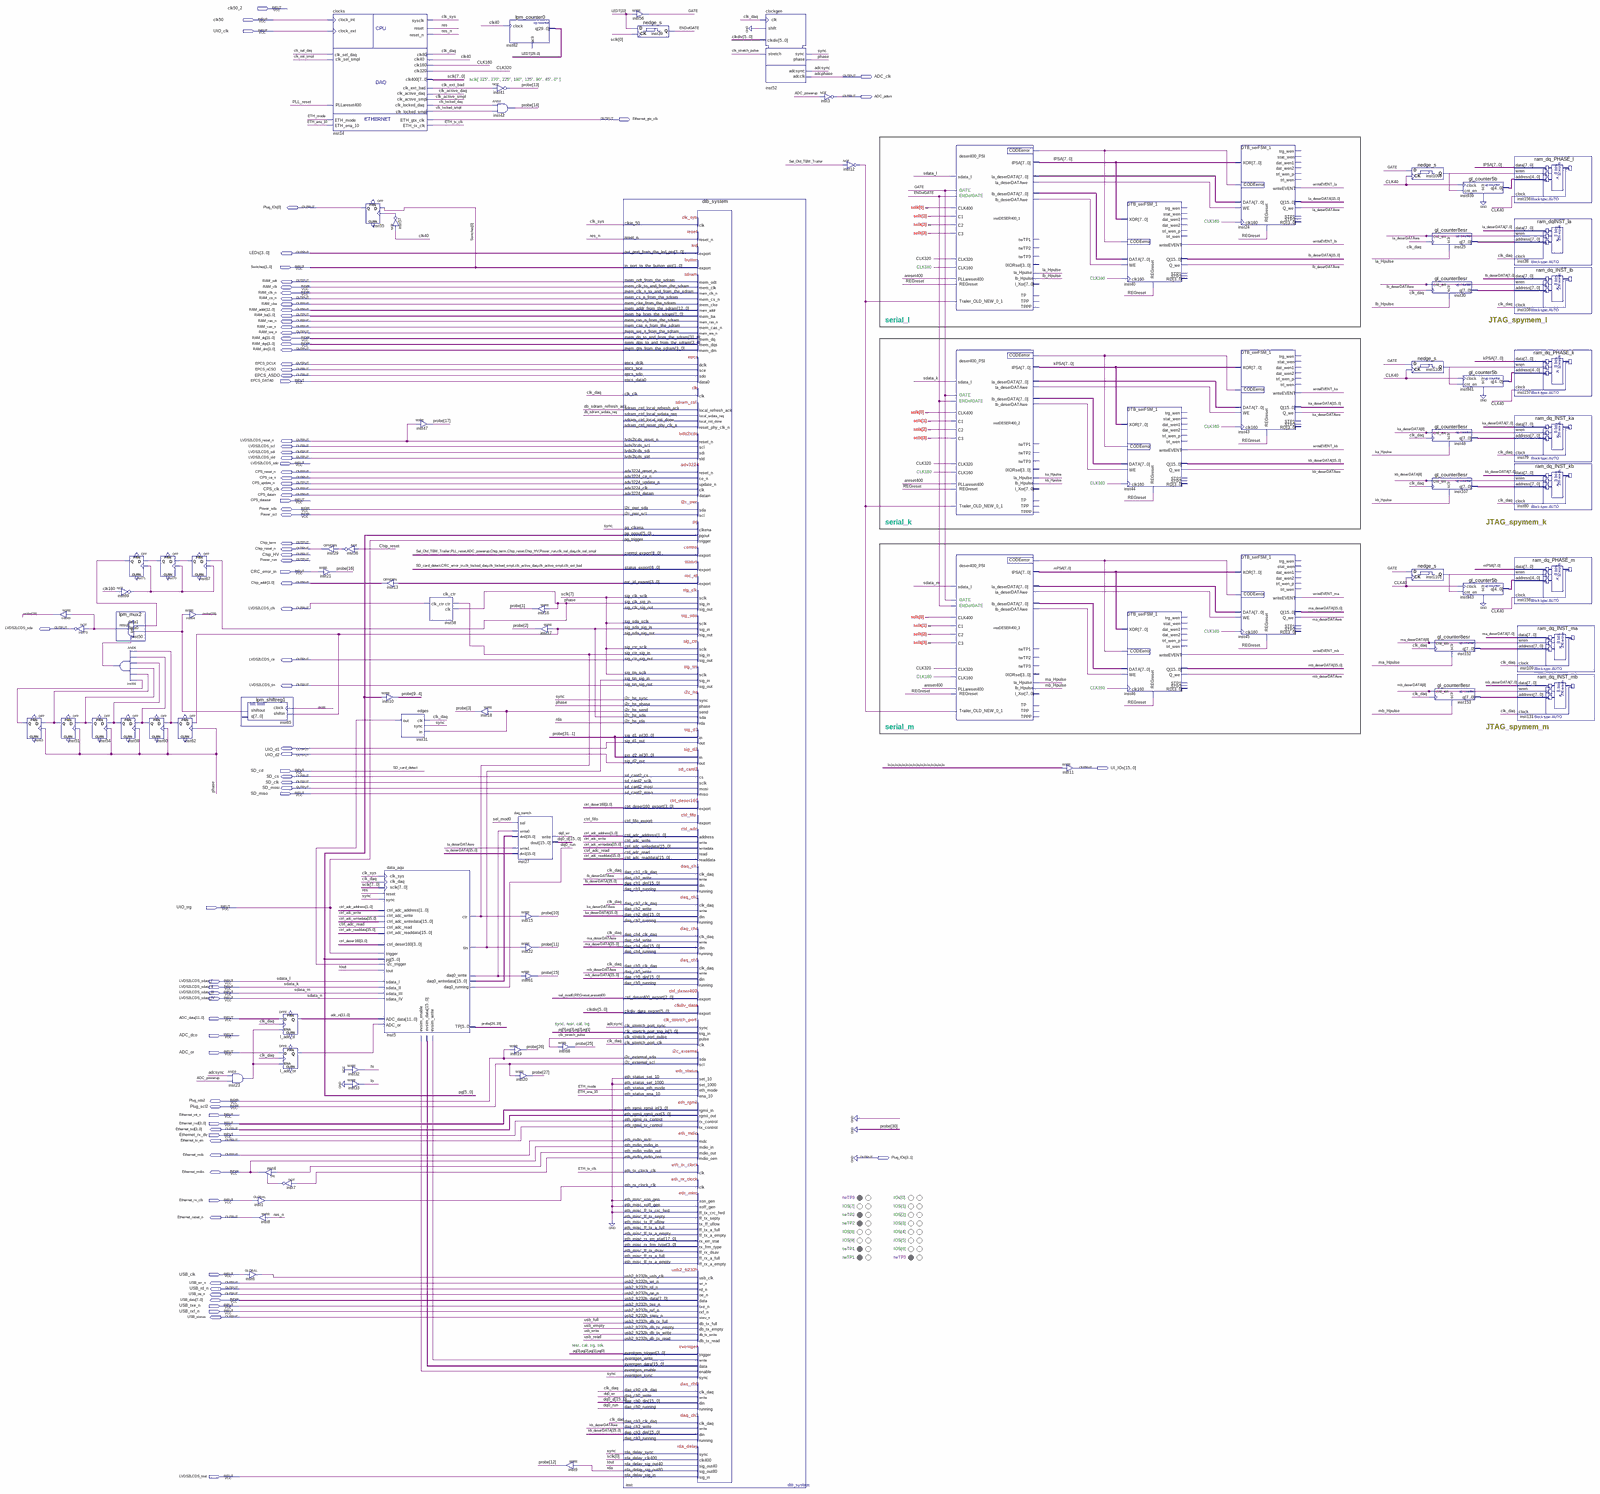
[diagram p0: schematic sheet, whole]
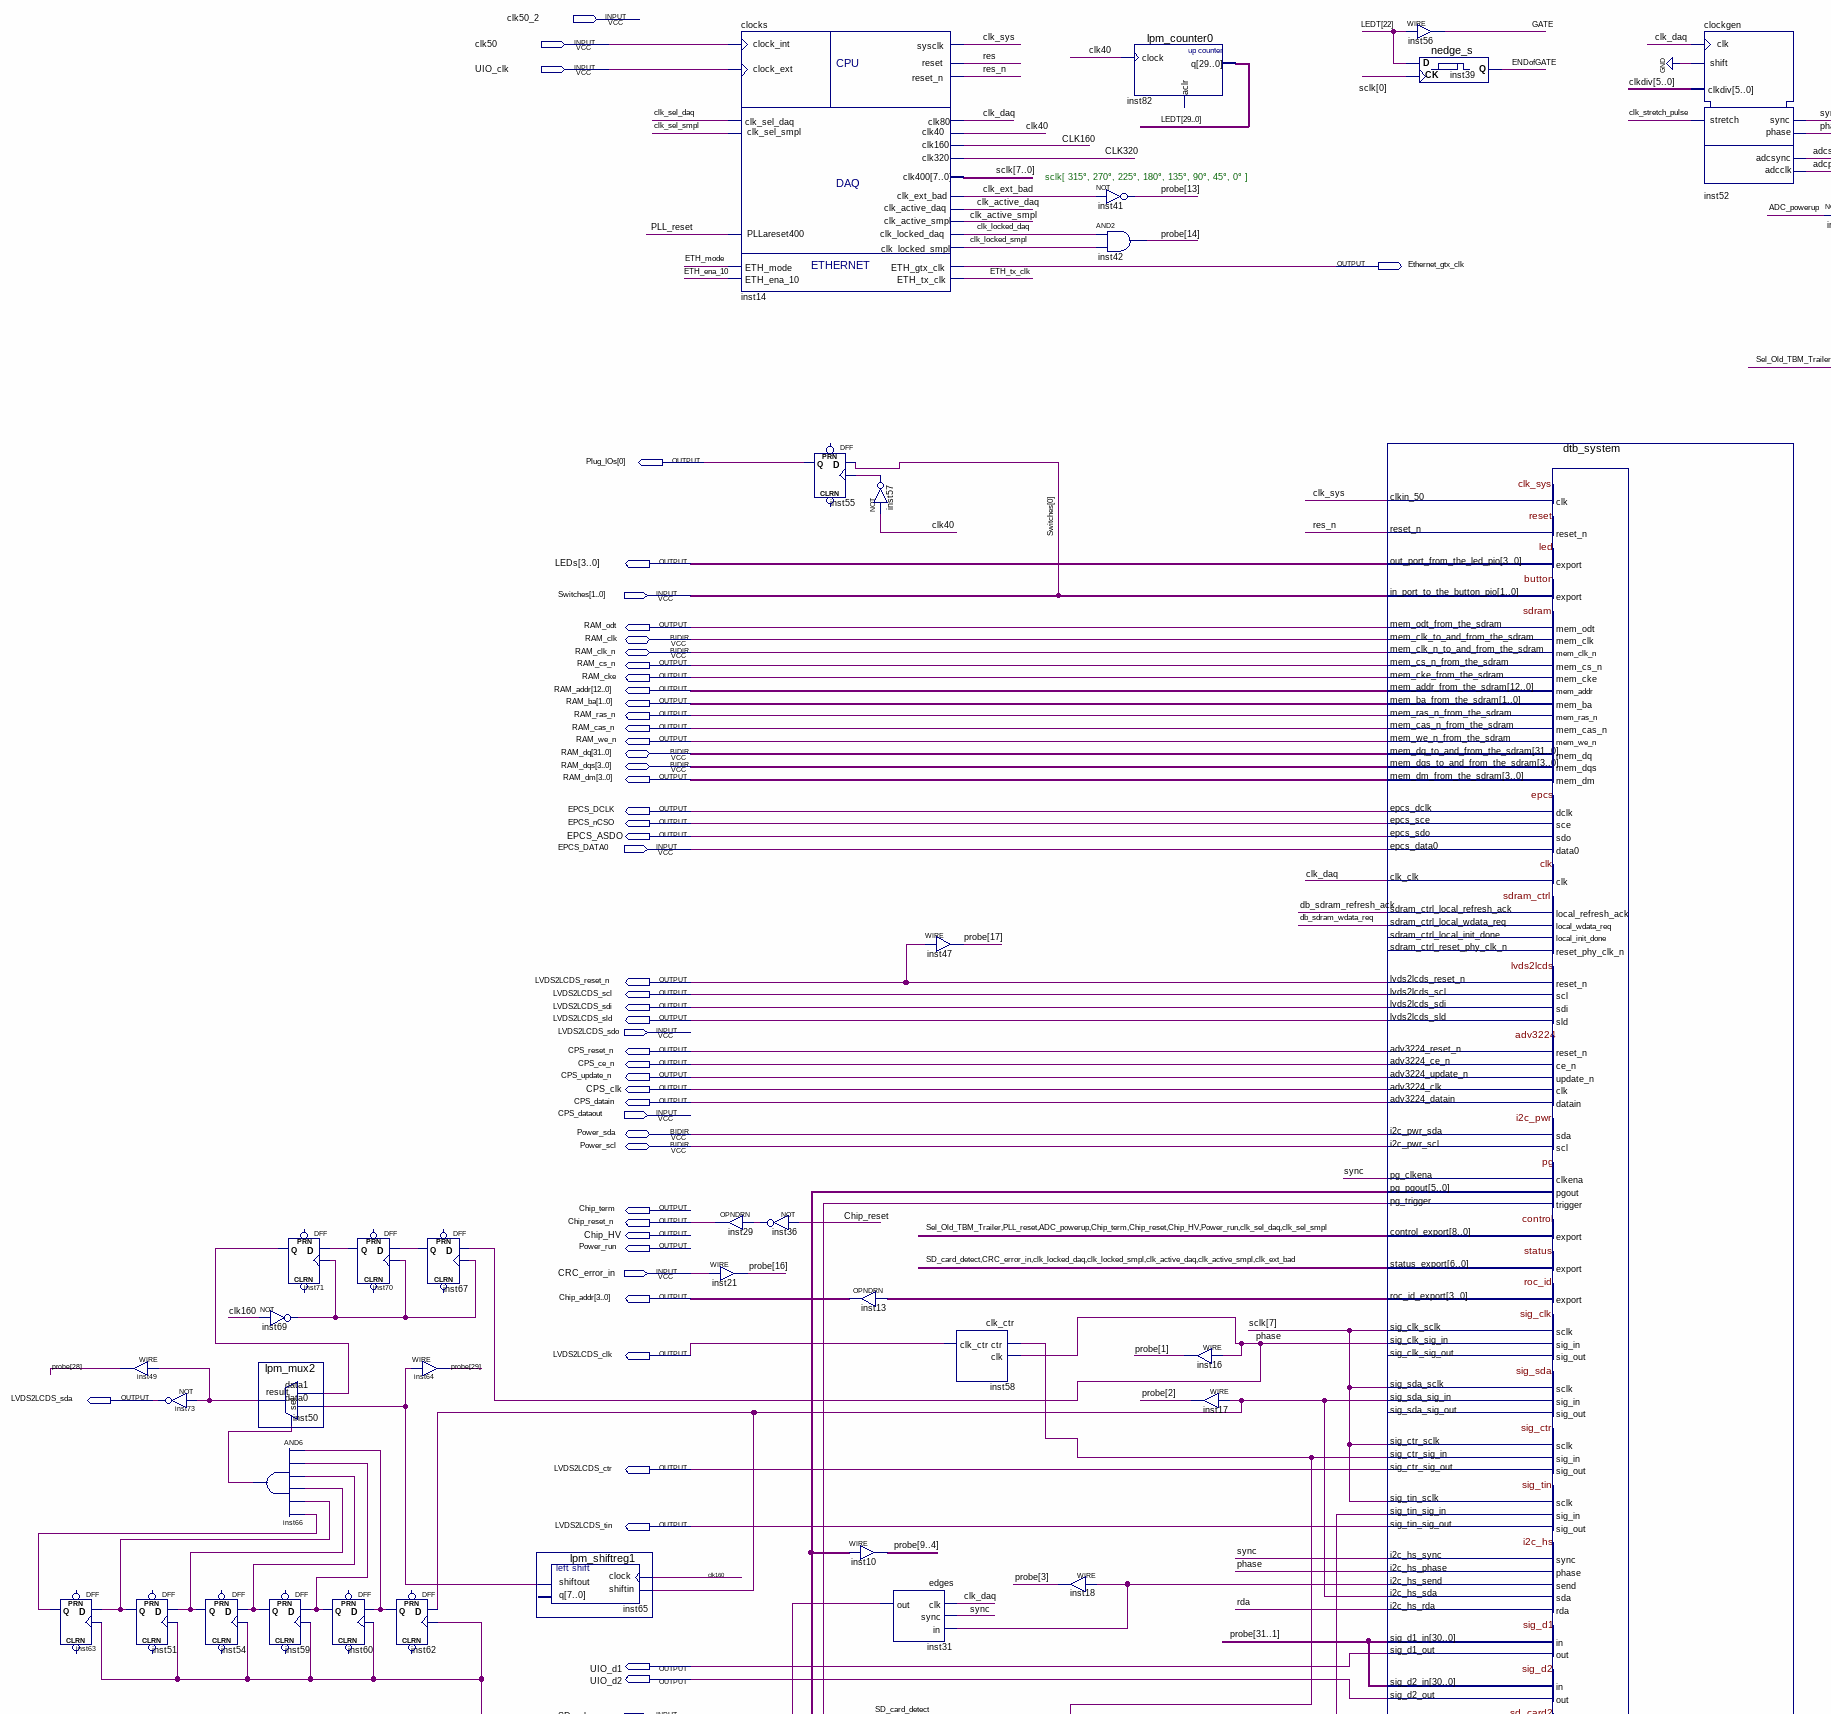
[diagram p1: schematic sheet, upper left part]
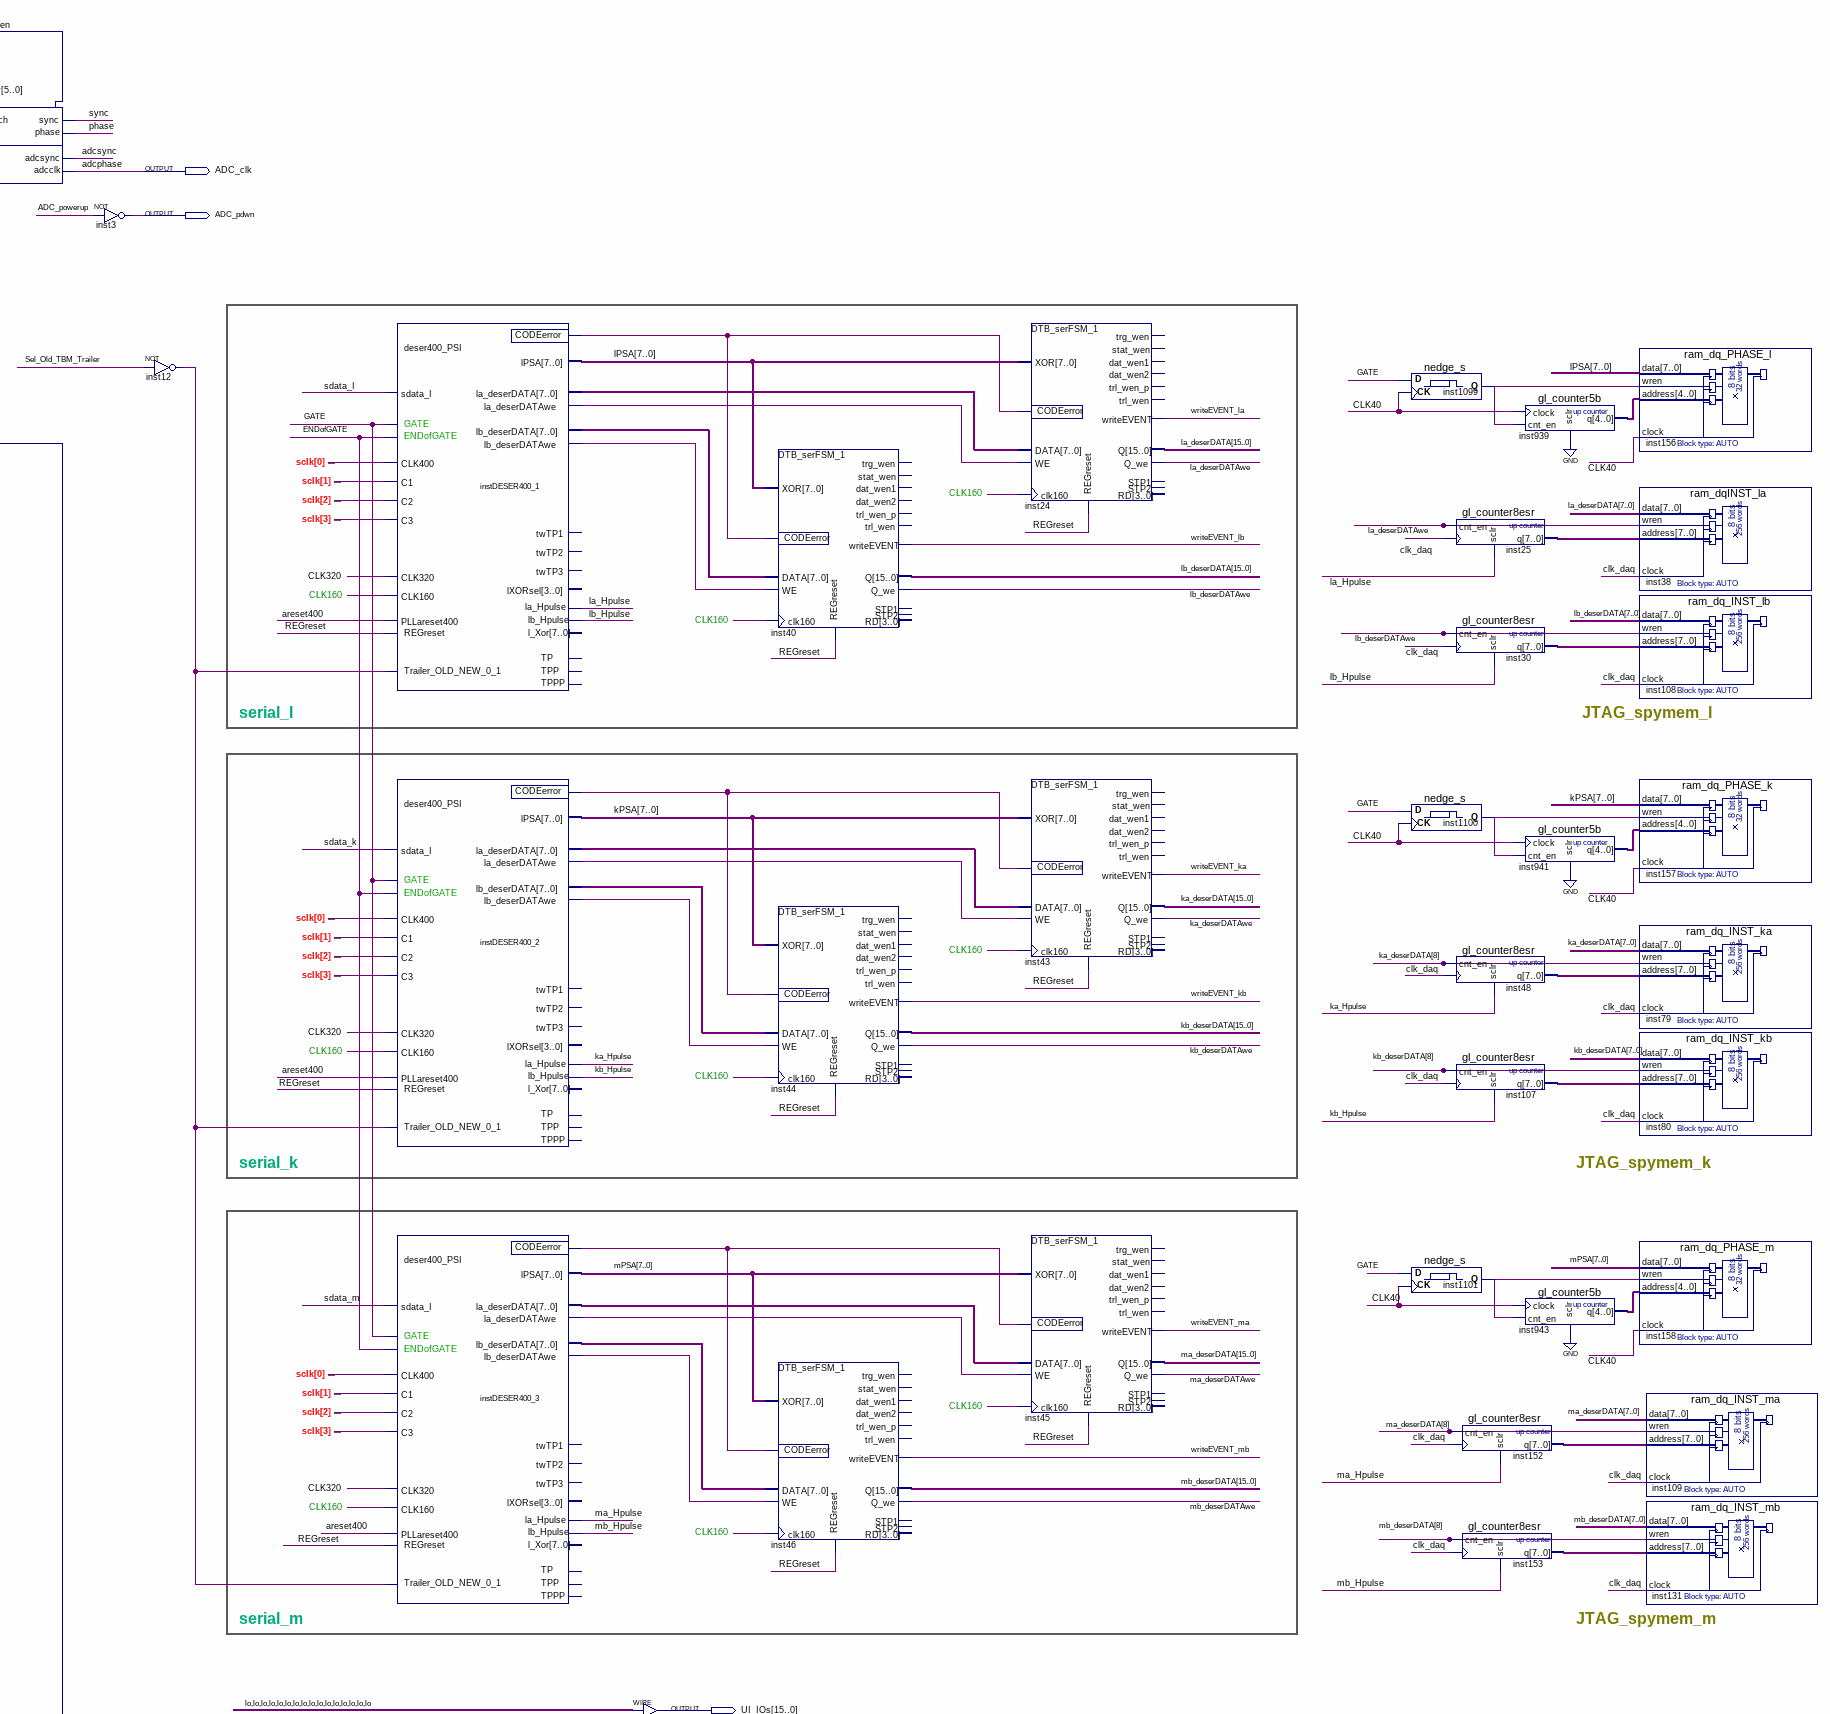
[diagram p2: schematic sheet, upper right part]
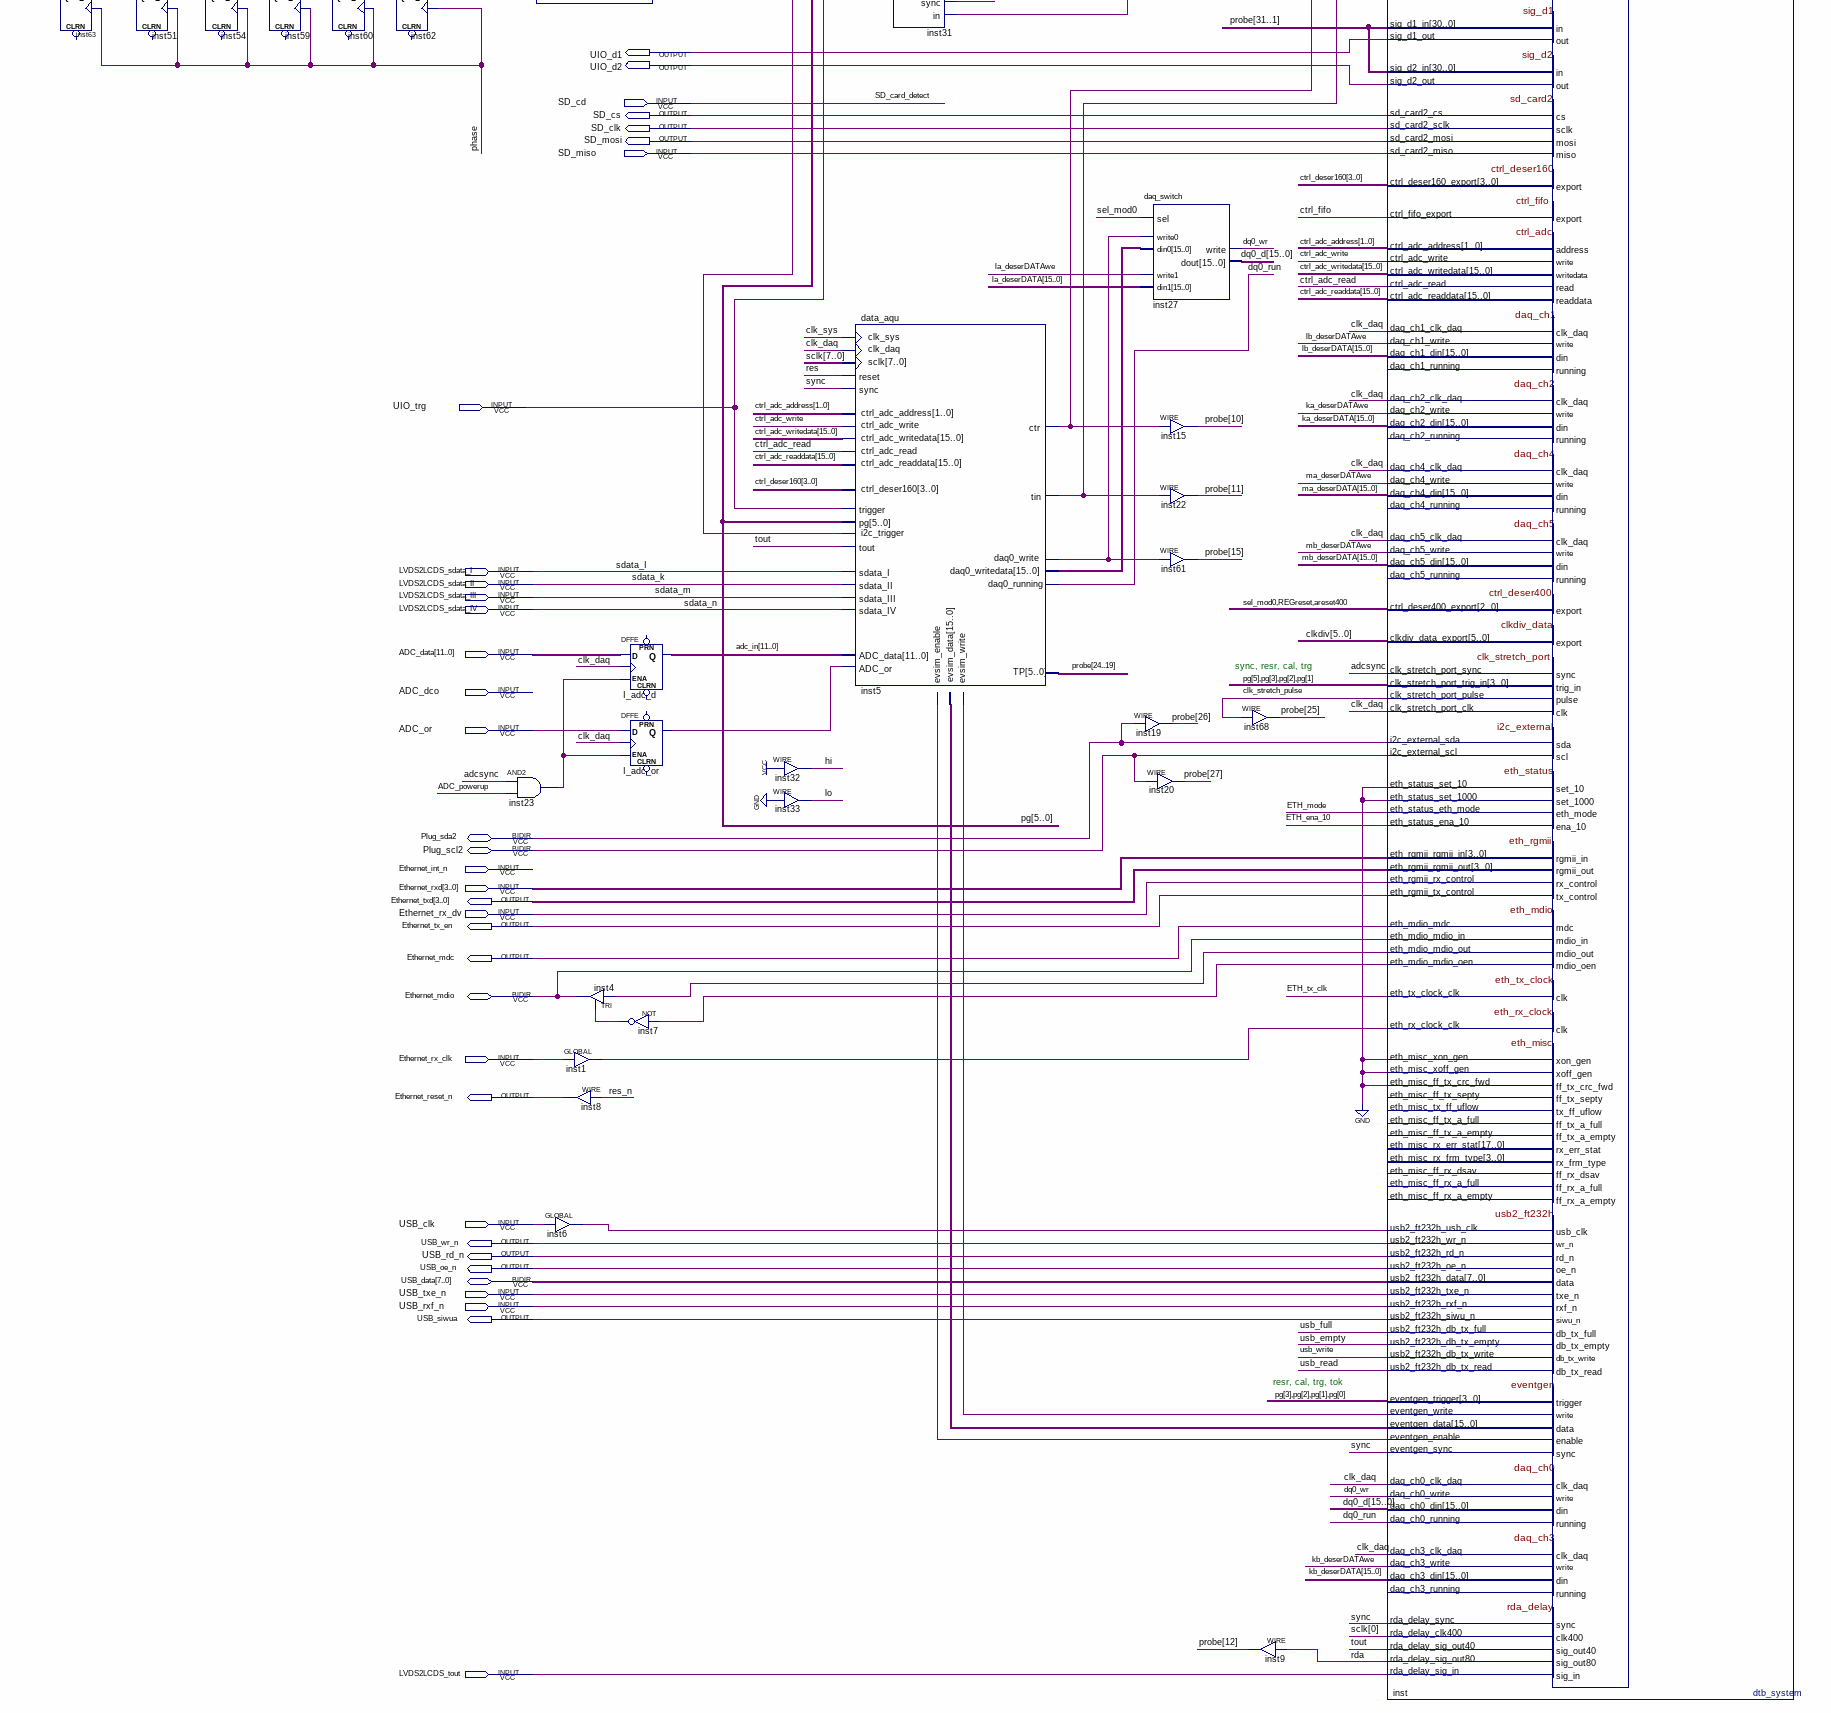
[diagram p3: schematic sheet, lower left part]
// Quartus schematic dtb.bdf as structural Verilog: 89 symbols, 86 pins
module dtb (
  input  clk50_2,
  input  clk50,
  input  UIO_clk,
  input  [1:0] Switches,
  input  EPCS_DATA0,
  input  LVDS2LCDS_sdo,
  input  CPS_dataout,
  input  CRC_error_in,
  input  SD_cd,
  input  SD_miso,
  input  UIO_trg,
  input  LVDS2LCDS_sdata_I,
  input  LVDS2LCDS_sdata_II,
  input  LVDS2LCDS_sdata_III,
  input  LVDS2LCDS_sdata_IV,
  input  [11:0] ADC_data,
  input  ADC_dco,
  input  ADC_or,
  input  Ethernet_int_n,
  input  [3:0] Ethernet_rxd,
  input  Ethernet_rx_dv,
  input  Ethernet_rx_clk,
  input  USB_clk,
  input  USB_txe_n,
  input  USB_rxf_n,
  input  LVDS2LCDS_tout,
  inout  RAM_clk,
  inout  RAM_clk_n,
  inout  [31:0] RAM_dq,
  inout  [3:0] RAM_dqs,
  inout  Power_sda,
  inout  Power_scl,
  inout  Plug_sda2,
  inout  Plug_scl2,
  inout  Ethernet_mdio,
  inout  [7:0] USB_data,
  output ADC_clk,
  output ADC_pdwn,
  output Ethernet_gtx_clk,
  output [3:0] Plug_IOs,
  output [3:0] LEDs,
  output RAM_odt,
  output RAM_cs_n,
  output RAM_cke,
  output [12:0] RAM_addr,
  output [1:0] RAM_ba,
  output RAM_ras_n,
  output RAM_cas_n,
  output RAM_we_n,
  output [3:0] RAM_dm,
  output EPCS_DCLK,
  output EPCS_nCSO,
  output EPCS_ASDO,
  output LVDS2LCDS_reset_n,
  output LVDS2LCDS_scl,
  output LVDS2LCDS_sdi,
  output LVDS2LCDS_sld,
  output CPS_reset_n,
  output CPS_ce_n,
  output CPS_update_n,
  output CPS_clk,
  output CPS_datain,
  output Chip_term,
  output Chip_reset_n,
  output Chip_HV,
  output Power_run,
  output [3:0] Chip_addr,
  output LVDS2LCDS_clk,
  output LVDS2LCDS_sda,
  output LVDS2LCDS_ctr,
  output LVDS2LCDS_tin,
  output UIO_d1,
  output UIO_d2,
  output [15:0] UI_IOs,
  output SD_cs,
  output SD_clk,
  output SD_mosi,
  output [3:0] Ethernet_txd,
  output Ethernet_tx_en,
  output Ethernet_mdc,
  output Ethernet_reset_n,
  output USB_wr_n,
  output USB_rd_n,
  output USB_oe_n,
  output USB_siwua
);

  wire ADC_powerup, adcsync, areset400, Chip_reset, CLK40, CLK160, CLK320, clk_active_daq, clk_active_smpl,
       clk_daq, clk_ext_bad, clk_locked_daq, clk_locked_smpl, clk_sel_daq, clk_sel_smpl, clk_stretch_pulse,
       clk_sys, ctrl_adc_read, ctrl_adc_write, ctrl_fifo, db_sdram_refresh_ack, db_sdram_wdata_req, dq0_run,
       dq0_wr, ENDofGATE, ETH_ena_10, ETH_mode, ETH_tx_clk, GATE, hi, I_adc_or_q, inst1_out, inst5_ctr,
       inst5_daq0_write, inst5_tin, inst6_out, inst7_out, inst12_out, inst23_out, inst31_out, inst36_out,
       inst50_result, inst51_q, inst54_q, inst57_out, inst59_q, inst60_q, inst62_q, inst63_q,
       inst65_shiftout, inst66_out, inst67_q, inst69_out, inst70_q, inst71_q, inst1099_q, inst1100_q,
       inst1101_q, inst_eth_mdio_mdio_oen, inst_eth_mdio_mdio_out, inst_eventgen_enable, inst_eventgen_write,
       inst_i2c_hs_sda, inst_i2c_hs_send, instDESER400_1_codeerror, instDESER400_1_la_deserdatawe,
       instDESER400_1_lb_deserdatawe, instDESER400_2_codeerror, instDESER400_2_la_deserdatawe,
       instDESER400_2_lb_deserdatawe, instDESER400_3_codeerror, instDESER400_3_la_deserdatawe,
       instDESER400_3_lb_deserdatawe, ka_deserDATAwe, ka_Hpulse, kb_deserDATAwe, kb_Hpulse, la_deserDATAwe,
       la_Hpulse, lb_deserDATAwe, lb_Hpulse, lo, ma_deserDATAwe, ma_Hpulse, mb_deserDATAwe, mb_Hpulse, phase,
       PLL_reset, rda, REGreset, res, res_n, sel_mod0, Sel_Old_TBM_Trailer, sync, tout, usb_empty, usb_full,
       usb_read, usb_write, writeEVENT_ka, writeEVENT_kb, writeEVENT_la, writeEVENT_lb, writeEVENT_ma,
       writeEVENT_mb;
  wire [1:0] ctrl_adc_address;
  wire [3:0] ctrl_deser160, inst_roc_id_export;
  wire [4:0] inst939_q, inst941_q, inst943_q;
  wire [5:0] clkdiv, pg;
  wire [7:0] inst25_q, inst30_q, inst48_q, inst107_q, inst152_q, inst153_q, instDESER400_1_la_deserdata,
       instDESER400_1_lb_deserdata, instDESER400_2_la_deserdata, instDESER400_2_lb_deserdata,
       instDESER400_3_la_deserdata, instDESER400_3_lb_deserdata, kPSA, lPSA, mPSA, sclk;
  wire [11:0] adc_in;
  wire [15:0] ctrl_adc_readdata, ctrl_adc_writedata, dq0_d, inst5_daq0_writedata, inst_eventgen_data,
       ka_deserDATA, kb_deserDATA, la_deserDATA, lb_deserDATA, ma_deserDATA, mb_deserDATA;
  wire [29:0] LEDT;
  wire [31:1] probe;

  DFF inst63 (.CLK(phase), .D(inst51_q), .Q(inst63_q));  // open: CLRN, PRN
  assign probe[28] = inst50_result;  // WIRE inst49
  DFF inst51 (.CLK(phase), .D(inst54_q), .Q(inst51_q));  // open: CLRN, PRN
  not inst73 (LVDS2LCDS_sda, inst50_result);
  DFF inst54 (.CLK(phase), .D(inst59_q), .Q(inst54_q));  // open: CLRN, PRN
  and inst66 (inst66_out, inst62_q, inst60_q, inst59_q, inst54_q, inst51_q, inst63_q);
  DFF inst71 (.CLK(inst69_out), .D(inst70_q), .Q(inst71_q));  // open: CLRN, PRN
  not inst69 (inst69_out, CLK160);
  lpm_mux2 inst50 (.data1(inst71_q), .data0(inst65_shiftout), .sel(inst66_out), .result(inst50_result));
  DFF inst59 (.CLK(phase), .D(inst60_q), .Q(inst59_q));  // open: CLRN, PRN
  DFF inst70 (.CLK(inst69_out), .D(inst67_q), .Q(inst70_q));  // open: CLRN, PRN
  DFF inst60 (.CLK(phase), .D(inst62_q), .Q(inst60_q));  // open: CLRN, PRN
  DFF inst62 (.CLK(phase), .D(inst_i2c_hs_sda), .Q(inst62_q));  // open: CLRN, PRN
  DFF inst67 (.CLK(inst69_out), .D(phase), .Q(inst67_q));  // open: CLRN, PRN
  assign probe[29] = inst65_shiftout;  // WIRE inst64
  and inst23 (inst23_out, adcsync, ADC_powerup);
  lpm_shiftreg1 inst65 (.clock(CLK160), .shiftin(inst_i2c_hs_sda), .shiftout(inst65_shiftout));  // open: q
  GLOBAL inst6 (.IN(USB_clk), .OUT(inst6_out));
  TRI inst4 (.IN(inst_eth_mdio_mdio_out), .OE(inst7_out), .OUT(Ethernet_mdio));
  GLOBAL inst1 (.IN(Ethernet_rx_clk), .OUT(inst1_out));
  assign Ethernet_reset_n = res_n;  // WIRE inst8
  DFFE I_adc_d[11:0] (.D(ADC_data), .CLK(clk_daq), .ENA(inst23_out), .Q(adc_in));  // open: PRN, CLRN
  DFFE I_adc_or (.D(ADC_or), .CLK(clk_daq), .ENA(inst23_out), .Q(I_adc_or_q));  // open: PRN, CLRN
  not inst7 (inst7_out, inst_eth_mdio_mdio_oen);
  assign probe[16] = CRC_error_in;  // WIRE inst21
  clocks inst14 (
    .clock_int(clk50), .clock_ext(UIO_clk), .clk_sel_daq(clk_sel_daq), .ETH_mode(ETH_mode),
    .ETH_ena_10(ETH_ena_10), .PLLareset400(PLL_reset), .clk_sel_smpl(clk_sel_smpl), .sysclk(clk_sys),
    .reset_n(res_n), .ETH_gtx_clk(Ethernet_gtx_clk), .ETH_tx_clk(ETH_tx_clk), .reset(res), .clk80(clk_daq),
    .clk40(CLK40), .clk160(CLK160), .clk320(CLK320), .clk400(sclk), .clk_active_smpl(clk_active_smpl),
    .clk_active_daq(clk_active_daq), .clk_ext_bad(clk_ext_bad), .clk_locked_daq(clk_locked_daq),
    .clk_locked_smpl(clk_locked_smpl));
  OPNDRN inst29 (.IN(inst36_out), .OUT(Chip_reset_n));
  not inst36 (inst36_out, Chip_reset);
  DFF inst55 (.CLK(inst57_out), .D(Switches[0]), .Q(Plug_IOs[0]));  // open: CLRN, PRN
  assign hi = 1'b1;  // WIRE inst32
  assign lo = 1'b0;  // WIRE inst33
  OPNDRN inst13[3:0] (.IN(inst_roc_id_export), .OUT(Chip_addr));
  assign probe[9:4] = pg;  // WIRE inst10
  data_aqu inst5 (
    .clk_daq(clk_daq), .reset(res), .sync(sync), .trigger(UIO_trg), .tout(tout), .sdata_I(LVDS2LCDS_sdata_I),
    .sdata_II(LVDS2LCDS_sdata_II), .sdata_III(LVDS2LCDS_sdata_III), .sdata_IV(LVDS2LCDS_sdata_IV),
    .ADC_or(I_adc_or_q), .ADC_data(adc_in), .pg(pg), .clk_sys(clk_sys), .sclk(sclk),
    .ctrl_deser160(ctrl_deser160), .daq0_running(dq0_run), .ctrl_adc_address(ctrl_adc_address),
    .ctrl_adc_write(ctrl_adc_write), .ctrl_adc_writedata(ctrl_adc_writedata), .ctrl_adc_read(ctrl_adc_read),
    .i2c_trigger(inst31_out), .evsim_enable(inst_eventgen_enable), .evsim_write(inst_eventgen_write),
    .evsim_data(inst_eventgen_data), .ctr(inst5_ctr), .tin(inst5_tin), .daq0_write(inst5_daq0_write),
    .daq0_writedata(inst5_daq0_writedata), .ctrl_adc_readdata(ctrl_adc_readdata), .TP(probe[24:19]));
  not inst57 (inst57_out, CLK40);
  edges inst31 (.clk(clk_daq), .sync(sync), .in(inst_i2c_hs_send), .out(inst31_out));
  assign probe[17] = LVDS2LCDS_reset_n;  // WIRE inst47
  clk_ctr inst58 (.ctr(inst5_ctr), .clk(phase), .clk_ctr(LVDS2LCDS_clk));
  assign probe[3] = inst_i2c_hs_send;  // WIRE inst18
  not inst41 (probe[13], clk_ext_bad);
  and inst42 (probe[14], clk_locked_daq, clk_locked_smpl);
  lpm_counter0 inst82 (.clock(CLK40), .q(LEDT));  // open: aclr
  daq_switch inst27 (
    .sel(sel_mod0), .write0(inst5_daq0_write), .din0(inst5_daq0_writedata), .write1(la_deserDATAwe),
    .din1(la_deserDATA), .write(dq0_wr), .dout(dq0_d));
  assign probe[10] = inst5_ctr;  // WIRE inst15
  assign probe[11] = inst5_tin;  // WIRE inst22
  assign probe[15] = inst5_daq0_write;  // WIRE inst61
  assign probe[26] = Plug_sda2;  // WIRE inst19
  assign probe[27] = Plug_scl2;  // WIRE inst20
  assign probe[1] = phase;  // WIRE inst16
  assign probe[2] = inst_i2c_hs_sda;  // WIRE inst17
  assign probe[25] = clk_stretch_pulse;  // WIRE inst68
  assign probe[12] = rda;  // WIRE inst9
  assign GATE = LEDT[22];  // WIRE inst56
  nedge_s inst39 (.D(LEDT[22]), .CK(sclk[0]), .Q(ENDofGATE));
  dtb_system inst (
    .clkin_50(clk_sys), .reset_n(res_n), .in_port_to_the_button_pio(Switches), .epcs_data0(EPCS_DATA0),
    .clk_clk(clk_daq), .pg_clkena(sync), .pg_trigger(UIO_trg),
    .status_export({SD_cd, CRC_error_in, clk_locked_daq, clk_locked_smpl, clk_active_daq, clk_active_smpl, clk_ext_bad}),
    .sig_clk_sclk(sclk[7]), .sig_clk_sig_in(phase), .sig_sda_sclk(sclk[7]), .sig_sda_sig_in(inst_i2c_hs_sda),
    .sig_ctr_sclk(sclk[7]), .sig_ctr_sig_in(inst5_ctr), .sig_tin_sclk(sclk[7]), .sig_tin_sig_in(inst5_tin),
    .i2c_hs_sync(sync), .i2c_hs_phase(phase), .i2c_hs_rda(rda), .sig_d1_in({probe[31], 1'b0, probe[29:1]}),
    .sig_d2_in({probe[31], 1'b0, probe[29:1]}), .sd_card2_miso(SD_miso),
    .ctrl_adc_readdata(ctrl_adc_readdata), .daq_ch1_clk_daq(clk_daq), .daq_ch1_write(lb_deserDATAwe),
    .daq_ch1_din(lb_deserDATA), .daq_ch2_clk_daq(clk_daq), .daq_ch2_write(ka_deserDATAwe),
    .daq_ch2_din(ka_deserDATA), .daq_ch4_clk_daq(clk_daq), .daq_ch4_write(ma_deserDATAwe),
    .daq_ch4_din(ma_deserDATA), .daq_ch5_clk_daq(clk_daq), .daq_ch5_write(mb_deserDATAwe),
    .daq_ch5_din(mb_deserDATA), .clk_stretch_port_sync(adcsync), .clk_stretch_port_trig_in({pg[5], pg[3:1]}),
    .clk_stretch_port_clk(clk_daq), .eth_status_set_10(1'b0), .eth_status_set_1000(1'b0),
    .eth_rgmii_rgmii_in(Ethernet_rxd), .eth_rgmii_rx_control(Ethernet_rx_dv),
    .eth_mdio_mdio_in(Ethernet_mdio), .eth_tx_clock_clk(ETH_tx_clk), .eth_rx_clock_clk(inst1_out),
    .eth_misc_xon_gen(1'b0), .eth_misc_xoff_gen(1'b0), .eth_misc_ff_tx_crc_fwd(1'b0),
    .usb2_ft232h_usb_clk(inst6_out), .usb2_ft232h_txe_n(USB_txe_n), .usb2_ft232h_rxf_n(USB_rxf_n),
    .eventgen_trigger(pg[3:0]), .eventgen_sync(sync), .daq_ch0_clk_daq(clk_daq), .daq_ch0_write(dq0_wr),
    .daq_ch0_din(dq0_d), .daq_ch3_clk_daq(clk_daq), .daq_ch3_write(kb_deserDATAwe),
    .daq_ch3_din(kb_deserDATA), .rda_delay_sync(sync), .rda_delay_clk400(sclk[0]),
    .rda_delay_sig_in(LVDS2LCDS_tout), .mem_odt_from_the_sdram(RAM_odt), .mem_cs_n_from_the_sdram(RAM_cs_n),
    .mem_cke_from_the_sdram(RAM_cke), .mem_addr_from_the_sdram(RAM_addr), .mem_ba_from_the_sdram(RAM_ba),
    .mem_ras_n_from_the_sdram(RAM_ras_n), .mem_cas_n_from_the_sdram(RAM_cas_n),
    .mem_we_n_from_the_sdram(RAM_we_n), .mem_dm_from_the_sdram(RAM_dm), .epcs_dclk(EPCS_DCLK),
    .epcs_sce(EPCS_nCSO), .epcs_sdo(EPCS_ASDO), .sdram_ctrl_local_refresh_ack(db_sdram_refresh_ack),
    .sdram_ctrl_local_wdata_req(db_sdram_wdata_req), .lvds2lcds_reset_n(LVDS2LCDS_reset_n),
    .lvds2lcds_scl(LVDS2LCDS_scl), .lvds2lcds_sdi(LVDS2LCDS_sdi), .lvds2lcds_sld(LVDS2LCDS_sld),
    .adv3224_reset_n(CPS_reset_n), .adv3224_ce_n(CPS_ce_n), .adv3224_update_n(CPS_update_n),
    .adv3224_clk(CPS_clk), .adv3224_datain(CPS_datain), .pg_pgout(pg),
    .control_export({Sel_Old_TBM_Trailer, PLL_reset, ADC_powerup, Chip_term, Chip_reset, Chip_HV, Power_run, clk_sel_daq, clk_sel_smpl}),
    .roc_id_export(inst_roc_id_export), .sig_ctr_sig_out(LVDS2LCDS_ctr), .sig_tin_sig_out(LVDS2LCDS_tin),
    .i2c_hs_send(inst_i2c_hs_send), .i2c_hs_sda(inst_i2c_hs_sda), .sig_d1_out(UIO_d1), .sig_d2_out(UIO_d2),
    .sd_card2_cs(SD_cs), .sd_card2_sclk(SD_clk), .sd_card2_mosi(SD_mosi),
    .ctrl_deser160_export(ctrl_deser160), .ctrl_fifo_export(ctrl_fifo), .ctrl_adc_address(ctrl_adc_address),
    .ctrl_adc_write(ctrl_adc_write), .ctrl_adc_writedata(ctrl_adc_writedata), .ctrl_adc_read(ctrl_adc_read),
    .ctrl_deser400_export({sel_mod0, REGreset, areset400}), .clkdiv_data_export(clkdiv),
    .clk_stretch_port_pulse(clk_stretch_pulse), .eth_status_eth_mode(ETH_mode),
    .eth_status_ena_10(ETH_ena_10), .eth_rgmii_rgmii_out(Ethernet_txd),
    .eth_rgmii_tx_control(Ethernet_tx_en), .eth_mdio_mdc(Ethernet_mdc),
    .eth_mdio_mdio_out(inst_eth_mdio_mdio_out), .eth_mdio_mdio_oen(inst_eth_mdio_mdio_oen),
    .usb2_ft232h_wr_n(USB_wr_n), .usb2_ft232h_rd_n(USB_rd_n), .usb2_ft232h_oe_n(USB_oe_n),
    .usb2_ft232h_siwu_n(USB_siwua), .usb2_ft232h_db_tx_full(usb_full), .usb2_ft232h_db_tx_empty(usb_empty),
    .usb2_ft232h_db_tx_write(usb_write), .usb2_ft232h_db_tx_read(usb_read),
    .eventgen_write(inst_eventgen_write), .eventgen_data(inst_eventgen_data),
    .eventgen_enable(inst_eventgen_enable), .daq_ch0_running(dq0_run), .rda_delay_sig_out40(tout),
    .rda_delay_sig_out80(rda), .out_port_from_the_led_pio(LEDs), .mem_clk_to_and_from_the_sdram(RAM_clk),
    .mem_clk_n_to_and_from_the_sdram(RAM_clk_n), .mem_dq_to_and_from_the_sdram(RAM_dq),
    .mem_dqs_to_and_from_the_sdram(RAM_dqs), .i2c_pwr_sda(Power_sda), .i2c_pwr_scl(Power_scl),
    .i2c_external_sda(Plug_sda2), .i2c_external_scl(Plug_scl2), .usb2_ft232h_data(USB_data));  // open: sdram_ctrl_local_init_done, sdram_ctrl_reset_phy_clk_n, sig_clk_sig_out, sig_sda_sig_out, daq_ch1_running, daq_ch2_running, daq_ch4_running, daq_ch5_running, eth_misc_ff_tx_septy, eth_misc_tx_ff_uflow, eth_misc_ff_tx_a_full, eth_misc_ff_tx_a_empty, eth_misc_rx_err_stat, eth_misc_rx_frm_type, eth_misc_ff_rx_dsav, eth_misc_ff_rx_a_full, eth_misc_ff_rx_a_empty, daq_ch3_running
  clockgen inst52 (
    .clk(clk_daq), .stretch(clk_stretch_pulse), .shift(1'b0), .clkdiv(clkdiv), .sync(sync), .phase(phase),
    .adcclk(ADC_clk), .adcsync(adcsync));
  not inst3 (ADC_pdwn, ADC_powerup);
  not inst12 (inst12_out, Sel_Old_TBM_Trailer);
  deser400_PSI instDESER400_1 (
    .sdata_I(LVDS2LCDS_sdata_I), .PLLareset400(areset400), .CLK400(sclk[0]), .C1(sclk[1]), .C2(sclk[2]),
    .C3(sclk[3]), .CLK320(CLK320), .CLK160(CLK160), .GATE(GATE), .ENDofGATE(ENDofGATE), .REGreset(REGreset),
    .Trailer_OLD_NEW_0_1(inst12_out), .la_deserDATA(instDESER400_1_la_deserdata),
    .la_deserDATAwe(instDESER400_1_la_deserdatawe), .lPSA(lPSA), .lb_deserDATA(instDESER400_1_lb_deserdata),
    .lb_deserDATAwe(instDESER400_1_lb_deserdatawe), .la_Hpulse(la_Hpulse), .lb_Hpulse(lb_Hpulse),
    .CODEerror(instDESER400_1_codeerror));  // open: twTP1, lXORsel, twTP2, twTP3, l_Xor, TP, TPP, TPPP
  deser400_PSI instDESER400_2 (
    .sdata_I(LVDS2LCDS_sdata_II), .PLLareset400(areset400), .CLK400(sclk[0]), .C1(sclk[1]), .C2(sclk[2]),
    .C3(sclk[3]), .CLK320(CLK320), .CLK160(CLK160), .GATE(GATE), .ENDofGATE(ENDofGATE), .REGreset(REGreset),
    .Trailer_OLD_NEW_0_1(inst12_out), .la_deserDATA(instDESER400_2_la_deserdata),
    .la_deserDATAwe(instDESER400_2_la_deserdatawe), .lPSA(kPSA), .lb_deserDATA(instDESER400_2_lb_deserdata),
    .lb_deserDATAwe(instDESER400_2_lb_deserdatawe), .la_Hpulse(ka_Hpulse), .lb_Hpulse(kb_Hpulse),
    .CODEerror(instDESER400_2_codeerror));  // open: twTP1, lXORsel, twTP2, twTP3, l_Xor, TP, TPP, TPPP
  deser400_PSI instDESER400_3 (
    .sdata_I(LVDS2LCDS_sdata_III), .PLLareset400(areset400), .CLK400(sclk[0]), .C1(sclk[1]), .C2(sclk[2]),
    .C3(sclk[3]), .CLK320(CLK320), .CLK160(CLK160), .GATE(GATE), .ENDofGATE(ENDofGATE), .REGreset(REGreset),
    .Trailer_OLD_NEW_0_1(inst12_out), .la_deserDATA(instDESER400_3_la_deserdata),
    .la_deserDATAwe(instDESER400_3_la_deserdatawe), .lPSA(mPSA), .lb_deserDATA(instDESER400_3_lb_deserdata),
    .lb_deserDATAwe(instDESER400_3_lb_deserdatawe), .la_Hpulse(ma_Hpulse), .lb_Hpulse(mb_Hpulse),
    .CODEerror(instDESER400_3_codeerror));  // open: twTP1, lXORsel, twTP2, twTP3, l_Xor, TP, TPP, TPPP
  assign UI_IOs = {16{lo}};  // WIRE inst11
  DTB_serFSM_1 inst40 (
    .clk160(CLK160), .DATA(instDESER400_1_lb_deserdata), .XOR(lPSA), .WE(instDESER400_1_lb_deserdatawe),
    .REGreset(REGreset), .CODEerror(instDESER400_1_codeerror), .Q(lb_deserDATA), .writeEVENT(writeEVENT_lb),
    .Q_we(lb_deserDATAwe));  // open: trg_wen, stat_wen, dat_wen1, RD, STP1, STP2, dat_wen2, trl_wen_p, trl_wen
  DTB_serFSM_1 inst44 (
    .clk160(CLK160), .DATA(instDESER400_2_lb_deserdata), .XOR(kPSA), .WE(instDESER400_2_lb_deserdatawe),
    .REGreset(REGreset), .CODEerror(instDESER400_2_codeerror), .Q(kb_deserDATA), .writeEVENT(writeEVENT_kb),
    .Q_we(kb_deserDATAwe));  // open: trg_wen, stat_wen, dat_wen1, RD, STP1, STP2, dat_wen2, trl_wen_p, trl_wen
  DTB_serFSM_1 inst46 (
    .clk160(CLK160), .DATA(instDESER400_3_lb_deserdata), .XOR(mPSA), .WE(instDESER400_3_lb_deserdatawe),
    .REGreset(REGreset), .CODEerror(instDESER400_3_codeerror), .Q(mb_deserDATA), .writeEVENT(writeEVENT_mb),
    .Q_we(mb_deserDATAwe));  // open: trg_wen, stat_wen, dat_wen1, RD, STP1, STP2, dat_wen2, trl_wen_p, trl_wen
  DTB_serFSM_1 inst24 (
    .clk160(CLK160), .DATA(instDESER400_1_la_deserdata), .XOR(lPSA), .WE(instDESER400_1_la_deserdatawe),
    .REGreset(REGreset), .CODEerror(instDESER400_1_codeerror), .Q(la_deserDATA), .writeEVENT(writeEVENT_la),
    .Q_we(la_deserDATAwe));  // open: trg_wen, stat_wen, dat_wen1, RD, STP1, STP2, dat_wen2, trl_wen_p, trl_wen
  DTB_serFSM_1 inst43 (
    .clk160(CLK160), .DATA(instDESER400_2_la_deserdata), .XOR(kPSA), .WE(instDESER400_2_la_deserdatawe),
    .REGreset(REGreset), .CODEerror(instDESER400_2_codeerror), .Q(ka_deserDATA), .writeEVENT(writeEVENT_ka),
    .Q_we(ka_deserDATAwe));  // open: trg_wen, stat_wen, dat_wen1, RD, STP1, STP2, dat_wen2, trl_wen_p, trl_wen
  DTB_serFSM_1 inst45 (
    .clk160(CLK160), .DATA(instDESER400_3_la_deserdata), .XOR(mPSA), .WE(instDESER400_3_la_deserdatawe),
    .REGreset(REGreset), .CODEerror(instDESER400_3_codeerror), .Q(ma_deserDATA), .writeEVENT(writeEVENT_ma),
    .Q_we(ma_deserDATAwe));  // open: trg_wen, stat_wen, dat_wen1, RD, STP1, STP2, dat_wen2, trl_wen_p, trl_wen
  nedge_s inst1099 (.D(GATE), .CK(CLK40), .Q(inst1099_q));
  nedge_s inst1100 (.D(GATE), .CK(CLK40), .Q(inst1100_q));
  nedge_s inst1101 (.D(GATE), .CK(CLK40), .Q(inst1101_q));
  gl_counter8esr inst25 (.cnt_en(la_deserDATAwe), .clock(clk_daq), .sclr(la_Hpulse), .q(inst25_q));
  gl_counter8esr inst30 (.cnt_en(lb_deserDATAwe), .clock(clk_daq), .sclr(lb_Hpulse), .q(inst30_q));
  gl_counter8esr inst48 (.cnt_en(ka_deserDATA[8]), .clock(clk_daq), .sclr(ka_Hpulse), .q(inst48_q));
  gl_counter8esr inst107 (.cnt_en(kb_deserDATA[8]), .clock(clk_daq), .sclr(kb_Hpulse), .q(inst107_q));
  gl_counter8esr inst152 (.cnt_en(ma_deserDATA[8]), .clock(clk_daq), .sclr(ma_Hpulse), .q(inst152_q));
  gl_counter8esr inst153 (.cnt_en(mb_deserDATA[8]), .clock(clk_daq), .sclr(mb_Hpulse), .q(inst153_q));
  gl_counter5b inst939 (.sclr(1'b0), .clock(CLK40), .cnt_en(inst1099_q), .q(inst939_q));
  gl_counter5b inst941 (.sclr(1'b0), .clock(CLK40), .cnt_en(inst1100_q), .q(inst941_q));
  gl_counter5b inst943 (.sclr(1'b0), .clock(CLK40), .cnt_en(inst1101_q), .q(inst943_q));
  ram_dq_PHASE_l inst156 (.data(lPSA), .wren(inst1099_q), .address(inst939_q), .clock(CLK40));
  ram_dqINST_la inst38 (.data(la_deserDATA[7:0]), .wren(la_deserDATAwe), .address(inst25_q), .clock(clk_daq));
  ram_dq_INST_lb inst108 (.data(lb_deserDATA[7:0]), .wren(lb_deserDATAwe), .address(inst30_q), .clock(clk_daq));
  ram_dq_PHASE_k inst157 (.data(kPSA), .wren(inst1100_q), .address(inst941_q), .clock(CLK40));
  ram_dq_INST_ka inst79 (.data(ka_deserDATA[7:0]), .wren(ka_deserDATA[8]), .address(inst48_q), .clock(clk_daq));
  ram_dq_INST_kb inst80 (.data(kb_deserDATA[7:0]), .wren(kb_deserDATA[8]), .address(inst107_q), .clock(clk_daq));
  ram_dq_PHASE_m inst158 (.data(mPSA), .wren(inst1101_q), .address(inst943_q), .clock(CLK40));
  ram_dq_INST_ma inst109 (.data(ma_deserDATA[7:0]), .wren(ma_deserDATA[8]), .address(inst152_q), .clock(clk_daq));
  ram_dq_INST_mb inst131 (.data(mb_deserDATA[7:0]), .wren(mb_deserDATA[8]), .address(inst153_q), .clock(clk_daq));

  assign Plug_IOs[3:1] = 3'b000;

  // Other names for the same wires on the sheet: adcphase = ADC_clk; SD_card_detect = SD_cd;
  //   sdata_I = LVDS2LCDS_sdata_I; sdata_k = LVDS2LCDS_sdata_II; sdata_m = LVDS2LCDS_sdata_III;
  //   sdata_n = LVDS2LCDS_sdata_IV

  // Notes on the sheet:
  //   sclk[ 315°, 270°, 225°, 180°, 135°, 90°, 45°, 0° ]
  //   serial_l
  //   JTAG_spymem_l
  //   serial_k
  //   JTAG_spymem_k
  //   serial_m
  //   JTAG_spymem_m
  //   sync, resr, cal, trg
  //   twTP3
  //   IOs[0]
  //   IOS[7]
  //   IOS[1]
  //   twTP2
  //   IOS[2]
  //   twTP2
  //   IOS[3]
  //   IOS[8]
  //   IOS[4]
  //   IOS[9]
  //   IOS[5]
  //   twTP1
  //   IOS[6]
  //   twTP1
  //   twTP3
  //   resr, cal, trg, tok
endmodule
